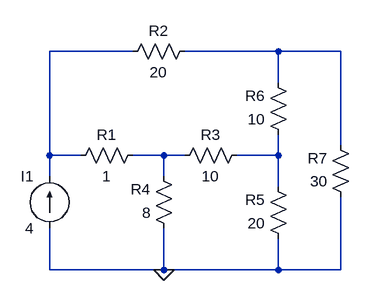
[diagram p0: schematic Draft27.asc]
Draft27.asc, the LTspice schematic file:
Version 4
SHEET 1 880 680
WIRE 176 -16 48 -16
WIRE 400 -16 256 -16
WIRE 496 -16 400 -16
WIRE 400 32 400 -16
WIRE 496 128 496 -16
WIRE 48 144 48 -16
WIRE 96 144 48 144
WIRE 224 144 176 144
WIRE 256 144 224 144
WIRE 400 144 400 112
WIRE 400 144 336 144
WIRE 48 176 48 144
WIRE 224 176 224 144
WIRE 400 192 400 144
WIRE 48 320 48 256
WIRE 224 320 224 256
WIRE 224 320 48 320
WIRE 400 320 400 272
WIRE 400 320 224 320
WIRE 496 320 496 208
WIRE 496 320 400 320
FLAG 224 320 0
SYMBOL current 48 256 R180
WINDOW 0 24 80 Left 2
WINDOW 3 24 0 Left 2
SYMATTR InstName I1
SYMATTR Value 4
SYMBOL res 192 128 R90
WINDOW 0 0 56 VBottom 2
WINDOW 3 32 56 VTop 2
SYMATTR InstName R1
SYMATTR Value 1
SYMBOL res 272 -32 R90
WINDOW 0 0 56 VBottom 2
WINDOW 3 32 56 VTop 2
SYMATTR InstName R2
SYMATTR Value 20
SYMBOL res 352 128 R90
WINDOW 0 0 56 VBottom 2
WINDOW 3 32 56 VTop 2
SYMATTR InstName R3
SYMATTR Value 10
SYMBOL res 240 272 R180
WINDOW 0 36 76 Left 2
WINDOW 3 36 40 Left 2
SYMATTR InstName R4
SYMATTR Value 8
SYMBOL res 416 288 R180
WINDOW 0 36 76 Left 2
WINDOW 3 36 40 Left 2
SYMATTR InstName R5
SYMATTR Value 20
SYMBOL res 416 128 R180
WINDOW 0 36 76 Left 2
WINDOW 3 36 40 Left 2
SYMATTR InstName R6
SYMATTR Value 10
SYMBOL res 512 224 R180
WINDOW 0 36 76 Left 2
WINDOW 3 36 40 Left 2
SYMATTR InstName R7
SYMATTR Value 30

The netlist it stands for:
* Draft27.asc
I1 0 N001 4
R1 N003 N001 1
R2 N002 N001 20
R3 N004 N003 10
R4 0 N003 8
R5 0 N004 20
R6 N004 N002 10
R7 0 N002 30
.backanno
.end